# EAGLE design spio (EAGLE 9.0.0)
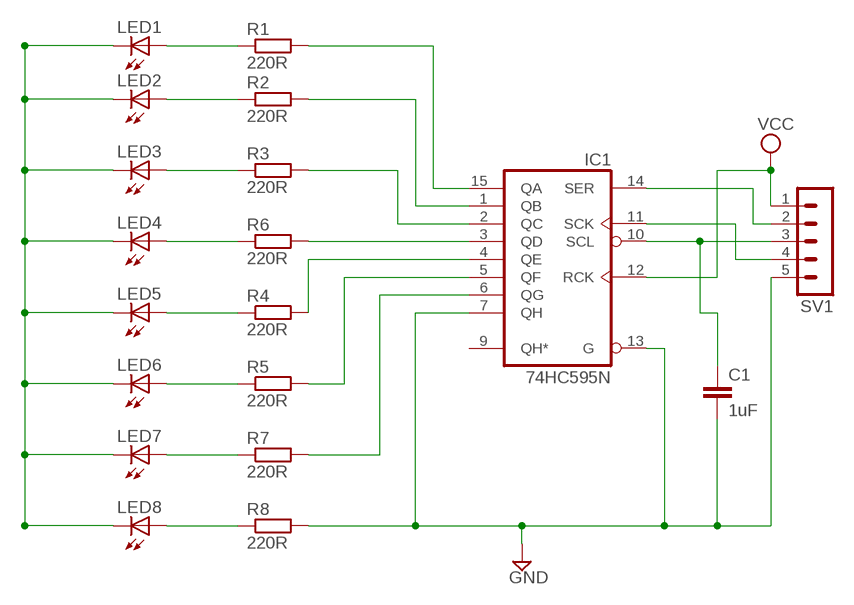
[diagram p0: schematic, sheet 1]

## Parts
C1  1uF  C-EU025-024X044  [C025-024X044]
IC1  74HC595N  [DIL16]
LED1  LED5MM  [LED5MM]
LED2  LED5MM  [LED5MM]
LED3  LED5MM  [LED5MM]
LED4  LED5MM  [LED5MM]
LED5  LED5MM  [LED5MM]
LED6  LED5MM  [LED5MM]
LED7  LED5MM  [LED5MM]
LED8  LED5MM  [LED5MM]
R1  220R  R-EU_0204/2V  [0204V]
R2  220R  R-EU_0204/2V  [0204V]
R3  220R  R-EU_0204/2V  [0204V]
R4  220R  R-EU_0204/2V  [0204V]
R5  220R  R-EU_0204/2V  [0204V]
R6  220R  R-EU_0204/2V  [0204V]
R7  220R  R-EU_0204/2V  [0204V]
R8  220R  R-EU_0204/2V  [0204V]
SV1  MA05-1  [MA05-1]

## Nets
GND: C1.2 IC1.7(QH) IC1.13(G) R8.2 SV1.5
N$1: LED1.A R1.1
N$2: LED2.A R2.1
N$3: LED3.A R3.1
N$4: LED4.A R6.1
N$5: LED5.A R4.1
N$6: LED6.A R5.1
N$7: LED7.A R7.1
N$8: LED8.A R8.1
N$9: LED1.K(C) LED2.K(C) LED3.K(C) LED4.K(C) LED5.K(C) LED6.K(C) LED7.K(C) LED8.K(C)
N$10: IC1.2(QC) R3.2
N$11: IC1.3(QD) R6.2
N$12: IC1.4(QE) R4.2
N$13: IC1.5(QF) R5.2
N$14: IC1.6(QG) R7.2
N$16: IC1.11(SCK) SV1.4
N$17: IC1.15(QA) R1.2
N$18: IC1.1(QB) R2.2
N$20: IC1.14(SER) SV1.2
N$22: C1.1 IC1.10(SCL) SV1.3
VCC: IC1.12(RCK) SV1.1
Unconnected: IC1.9(QH*)

## Power pins joined to a net without a drawn wire
GND: IC1.8(GND)
VCC: IC1.16(VCC)

## Library data of the parts
C1 = rcl:C-EU: CAPACITOR, European symbol; SPICEPREFIX: C
IC1 = 74xx-eu:74*595: 8-bit SHIFT REGISTER, output latch
LED1-LED8 = led:LED: LED OSRAM: - CHIPLED LG R971, LG N971, LY N971, LG Q971, LY Q971, LO R971, LY R971 LH N974, LH R974 LS Q976, LO Q976, LY Q976 LO Q996 - Hyper CHIPLED LW Q18S LB Q993, LB Q99A, LB R99A - SideLED LS A670, LO A670, LY A670, LG A670, LP A670 LB A673, LV A673, LT A673, LW A673 LH A674 LY A675 LS A676, LA A676, LO A676, LY A676, LW A676 LS A679, LY A679, LG A679 - Hyper Micro SIDELED® LS Y876, LA Y876, LO Y876, LY Y876 LT Y87S - SmartLED LW L88C, LW L88S LB L89C, LB L89S, LG L890 LS L89K, LO L89K, LY L89K LS L896, LA L896, LO L896, LY L896 - TOPLED LS T670, LO T670, LY T670, LG T670, LP T670 LSG T670, LSP T670, LSY T670, LOP T670, LYG T670 LG T671, LOG T671, LSG T671 LB T673, LV T673, LT T673, LW T673 LH T674 LS T676, LA T676, LO T676, LY T676, LB T676, LH T676, LSB T676, LW T676 LB T67C, LV T67C, LT T67C, LS T67K, LO T67K, LY T67K, LW E67C LS E67B, LA E67B, LO E67B, LY E67B, LB E67C, LV E67C, LT E67C LW T67C LS T679, LY T679, LG T679 LS T770, LO T770, LY T770, LG T770, LP T770 LB T773, LV T773, LT T773, LW T773 LH T774 LS E675, LA E675, LY E675, LS T675 LS T776, LA T776, LO T776, LY T776, LB T776 LHGB T686 LT T68C, LB T68C - Hyper Mini TOPLED® LB M676 - Mini TOPLED Santana® LG M470 LS M47K, LO M47K, LY M47K Source: http://www.osram.convergy.de LUXEON: - LUMILED® LXK2-PW12-R00, LXK2-PW12-S00, LXK2-PW14-U00, LXK2-PW14-V00 LXK2-PM12-R00, LXK2-PM12-S00, LXK2-PM14-U00 LXK2-PE12-Q00, LXK2-PE12-R00, LXK2-PE12-S00, LXK2-PE14-T00, LXK2-PE14-U00 LXK2-PB12-K00, LXK2-PB12-L00, LXK2-PB12-M00, LXK2-PB14-N00, LXK2-PB14-P00, LXK2-PB14-Q00 LXK2-PR12-L00, LXK2-PR12-M00, LXK2-PR14-Q00, LXK2-PR14-R00 LXK2-PD12-Q00, LXK2-PD12-R00, LXK2-PD12-S00 LXK2-PH12-R00, LXK2-PH12-S00 LXK2-PL12-P00, LXK2-PL12-Q00, LXK2-PL12-R00 Source: www.luxeon.com KINGBRIGHT: KA-3528ASYC Source: www.kingbright.com
R1-R8 = rcl:R-EU_: RESISTOR, European symbol; SPICEPREFIX: R
SV1 = con-lstb:MA05-1: PIN HEADER; OC_FARNELL: unknown; OC_NEWARK: unknown

## Board
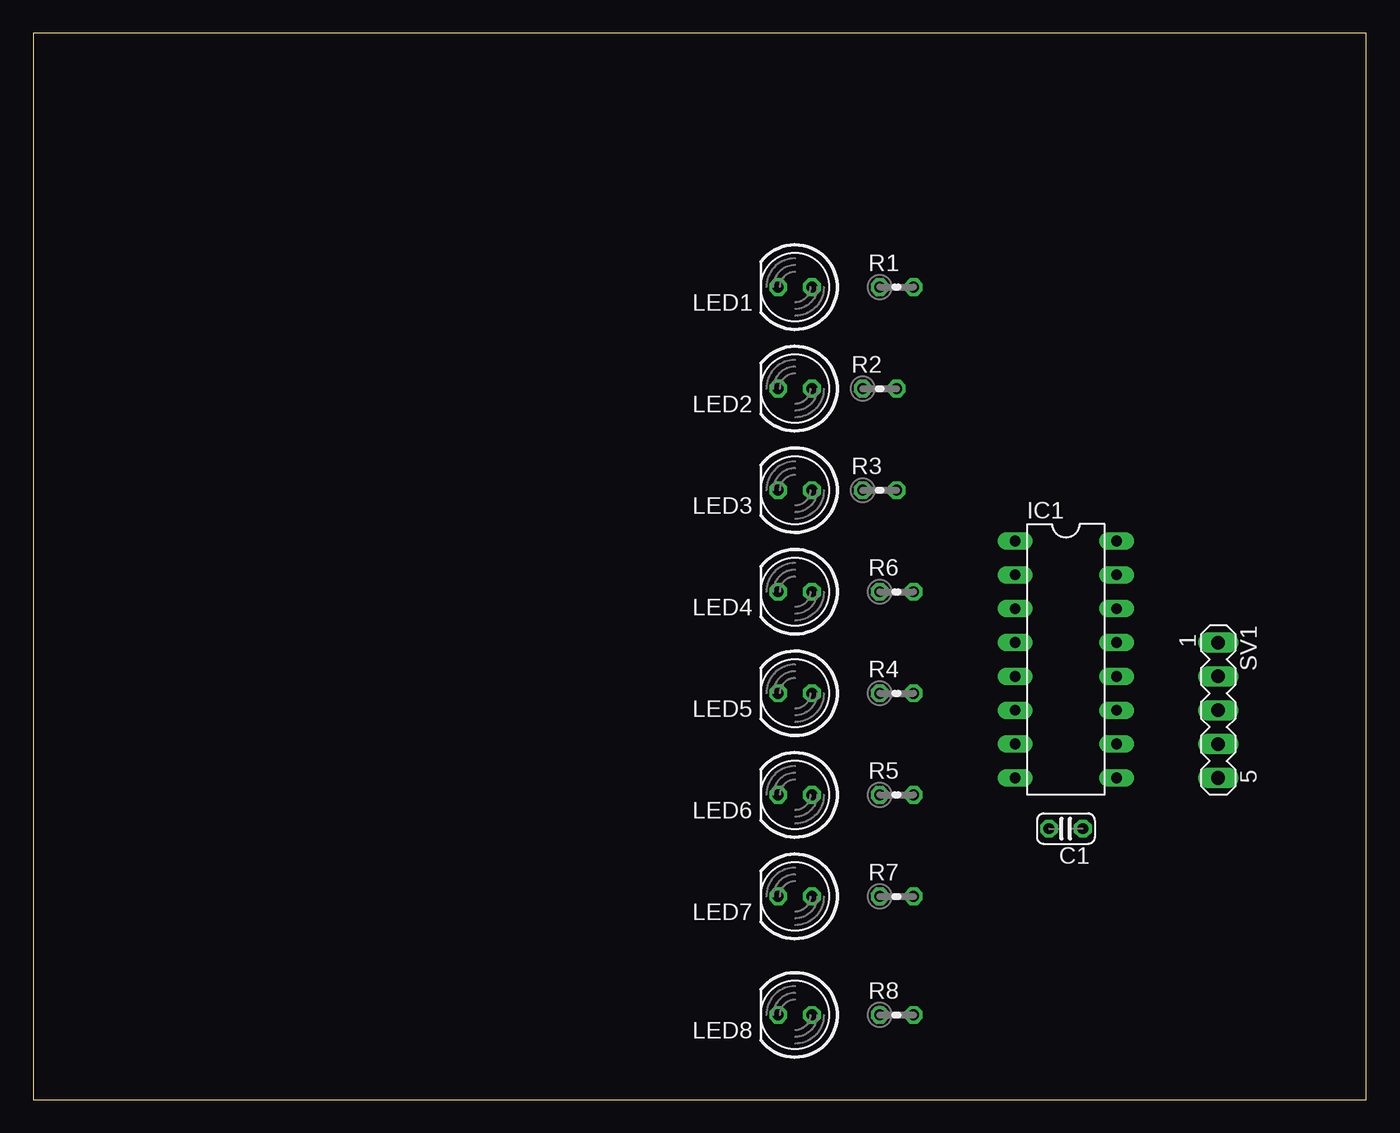
[diagram p1: board, top side]
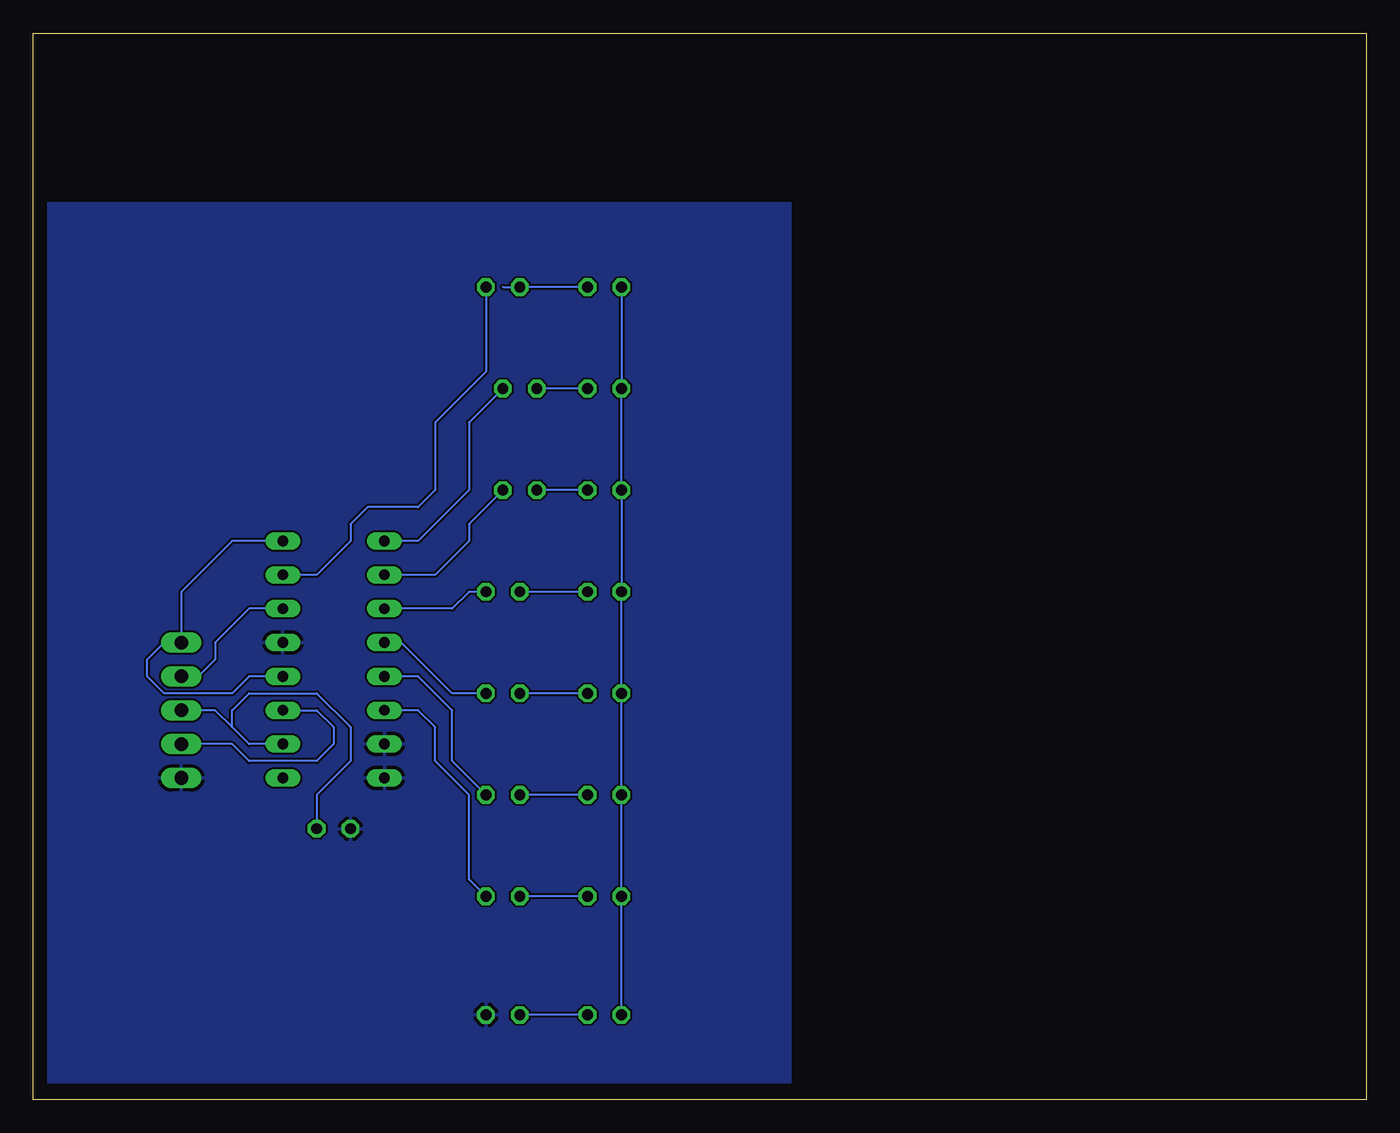
[diagram p2: board, bottom side, seen from below]

Size 100 x 80 mm. Coordinates in mm from the lower left corner, seen from the top.
Outline: 0,0 100,0 100,80 0,80 0,0
Copper layers (1*16): Top 0.035mm / dielectric 1.5mm / Bottom 0.035mm
Design rules "default": minimum track width 6mil, minimum drill 0.35mm, track to track 6mil, track to pad 6mil, pad to pad 6mil, via to via 6mil, smd to smd 6mil, copper to edge 40mil, drill to drill 6mil, minimum pad ring 10mil, minimum via ring 8mil, stop-mask expansion 4mil, vias tented up to drill 0mil, thermal gap 10mil

### Footprints (pad centres in the part's own frame; a part is rotated, then mirrored left to right if it is on the bottom)
C025-024X044 = drill 0.813 octagon: 1 -1.27,0; 2 1.27,0
DIL16 = drill 0.813 long: 1 -8.89,-3.81; 2 -6.35,-3.81; 3 -3.81,-3.81; 4 -1.27,-3.81; 5 1.27,-3.81; 6 3.81,-3.81; 7 6.35,-3.81; 8 8.89,-3.81; 9 8.89,3.81; 10 6.35,3.81; 11 3.81,3.81; 12 1.27,3.81; 13 -1.27,3.81; 14 -3.81,3.81; 15 -6.35,3.81; 16 -8.89,3.81
LED5MM = drill 0.813 octagon: A -1.27,0; K 1.27,0
0204V = drill 0.813 octagon: 1 -1.27,0; 2 1.27,0
MA05-1 = drill 1.016 long: 1 -5.08,0; 2 -2.54,0; 3 0,0; 4 2.54,0; 5 5.08,0

### Placement (x,y rotation side)
C1  77.47,20.32 180 top
IC1  77.47,33.02 270 top
LED1  57.15,60.96 180 top
LED2  57.15,53.34 180 top
LED3  57.15,45.72 180 top
LED4  57.15,38.1 180 top
LED5  57.15,30.48 180 top
LED6  57.15,22.86 180 top
LED7  57.15,15.24 180 top
LED8  57.15,6.35 180 top
R1  64.77,60.96 0 top
R2  63.5,53.34 0 top
R3  63.5,45.72 0 top
R4  64.77,30.48 0 top
R5  64.77,22.86 0 top
R6  64.77,38.1 0 top
R7  64.77,15.24 0 top
R8  64.77,6.35 0 top
SV1  88.9,29.21 270 top

### Tracks (layer width: path | path; a pad name or v marks a point on that pad's centre or on a via)
GND
  pour Bottom: 43.18,64.77 43.18,1.27 99.06,1.27 99.06,67.31 43.18,67.31
N$1
  Bottom 0.152: LED1.A R1.1 64.77,60.96
N$2
  Bottom 0.152: LED2.A R2.1
N$3
  Bottom 0.152: LED3.A R3.1
N$4
  Bottom 0.152: LED4.A R6.1
N$5
  Bottom 0.152: LED5.A R4.1
N$6
  Bottom 0.152: LED6.A R5.1
N$7
  Bottom 0.152: LED7.A R7.1
N$8
  Bottom 0.152: LED8.A R8.1
N$9
  Bottom 0.152: LED8.K LED7.K LED6.K LED5.K LED4.K LED3.K LED2.K LED1.K
N$10
  Bottom 0.152: R3.2 67.31,43.18 67.31,41.91 69.85,39.37 IC1.2
N$11
  Bottom 0.152: R6.2 67.31,38.1 68.58,36.83 IC1.3
N$12
  Bottom 0.152: R4.2 68.58,30.48 72.39,34.29 IC1.4
N$13
  Bottom 0.152: R5.2 68.58,25.4 68.58,29.21 71.12,31.75 IC1.5
N$14
  Bottom 0.152: R7.2 67.31,16.51 67.31,22.86 69.85,25.4 69.85,27.94 71.12,29.21 IC1.6
N$16
  Bottom 0.152: IC1.11 78.74,29.21 77.47,27.94 77.47,26.67 78.74,25.4 83.82,25.4 85.09,26.67 SV1.4
N$17
  Bottom 0.152: R1.2 66.04,54.61 69.85,50.8 69.85,45.72 71.12,44.45 74.93,44.45 76.2,43.18 76.2,41.91 78.74,39.37 IC1.15
N$18
  Bottom 0.152: R2.2 67.31,50.8 67.31,45.72 71.12,41.91 IC1.1
N$20
  Bottom 0.152: IC1.14 83.82,36.83 86.36,34.29 86.36,33.02 87.63,31.75 SV1.2
N$22
  Bottom 0.152: IC1.10 83.82,26.67 85.09,27.94 | 85.09,27.94 86.36,29.21 SV1.3 | 85.09,27.94 85.09,29.21 83.82,30.48 78.74,30.48 76.2,27.94 76.2,25.4 78.74,22.86 C1.1
VCC
  Bottom 0.152: IC1.16 85.09,41.91 88.9,38.1 SV1.1 90.17,34.29 91.44,33.02 91.44,31.75 90.17,30.48 88.9,30.48 85.09,30.48 83.82,31.75 IC1.12